# Altium schematic sheet Optical_SCH.SchDoc
size A4
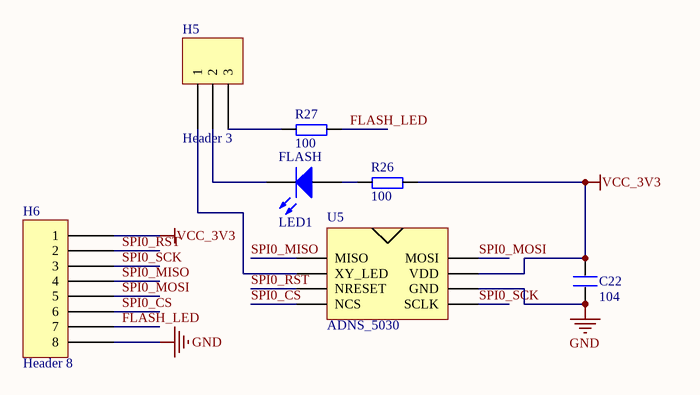
[diagram p0: Optical_SCH.SchDoc]

## Parts
C22  104  [0603P]
FLASH  LED1  [LED_A2]
H5  Header 3  [head3]
H6  Header 8  [Header 8]
R26  100  [0603P]
R27  100  [0603P]
U5  ADNS_5030  [ADNS_5030]

## Nets
GND: C22.1 H6.8 U5.6(GND)
VCC_3V3: C22.2 H6.1 R26.2 U5.7(VDD)
FLASH_LED: H6.7 R27.2
SPI0_CS: H6.6 U5.4(NCS)
SPI0_MISO: H6.4 U5.1(MISO)
SPI0_MOSI: H6.5 U5.8(MOSI)
SPI0_RST: H6.2 U5.3(NRESET)
SPI0_SCK: H6.3 U5.5(SCLK)
NetFLASH_1: FLASH.1(A) R26.1
NetFLASH_2: FLASH.2(K) H5.2
NetH5_1: H5.1 U5.2(XY_LED)
NetH5_3: H5.3 R27.1

## Library data of the parts
C22 = C
FLASH = LED2: Typical RED, GREEN, YELLOW, AMBER GaAs LED; Published: 8-Jun-2000; LatestRevisionDate: 17-Jul-2002; LatestRevisionNote: Re-released for DXP Platform.; PackageDocument: Feb-2002; PackageReference: 3.2X1.6X1.1; Publisher: Altium Limited
R26 R27 = R